# Altium schematic sheet OK1050-C_V1.2_Lcd.SchDoc
size A3; Revision: 1.2; SheetNumber: 3; SheetTotal: 7
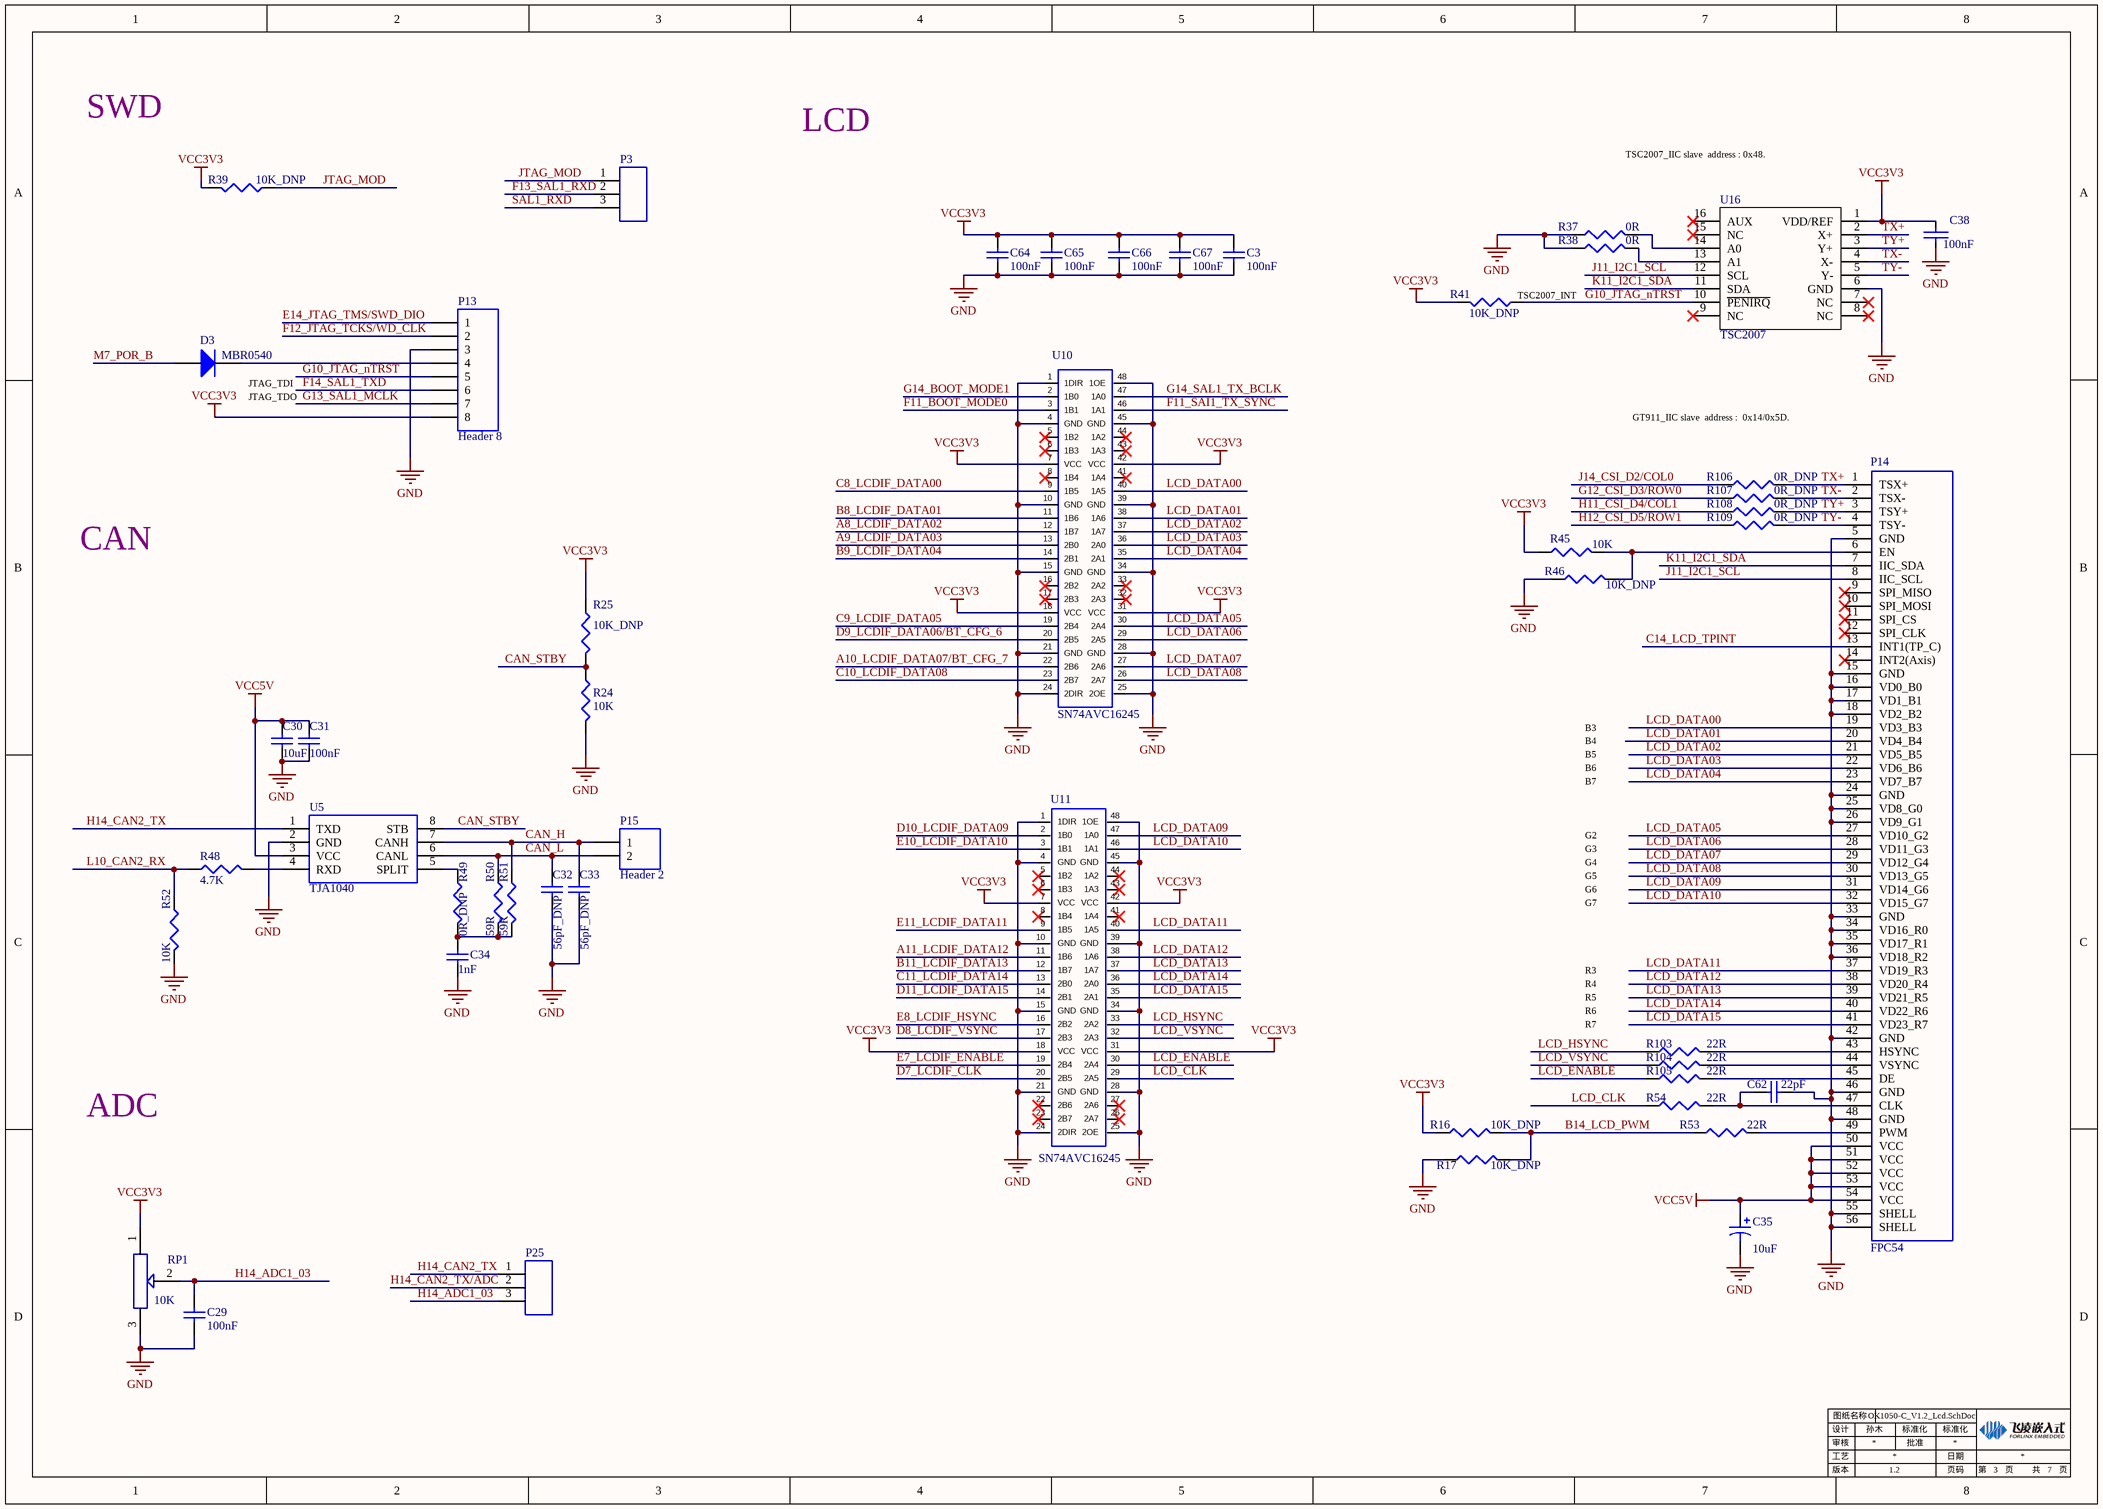
[diagram p0: OK1050-C_V1.2_Lcd.SchDoc]

## Parts
C3  100nF  [0603C+]
C29  100nF  [0603C+]
C30  10uF  [0603C+]
C31  100nF  [0603C+]
C32  56pF_DNP  [0603C+]
C33  56pF_DNP  [0603C+]
C34  1nF  [0603C+]
C35  10uF  [TC3216A]
C38  100nF  [0603C+]
C62  22pF  [0603C+]
C64  100nF  [0603C+]
C65  100nF  [0603C+]
C66  100nF  [0603C+]
C67  100nF  [0603C+]
D3  MBR0540  [Diode1.6*2.6]
P3  P25  [HDR1X3]  (value not drawn)
P13  Header 8  [HDR1X8]
P14  FPC54  [FPC54]
P15  Header 2  [DG128-2P]
P25  P25  [HDR1X3]  (value not drawn)
R16  10K_DNP  [0603R+]
R17  10K_DNP  [0603R+]
R24  10K  [0603R+]
R25  10K_DNP  [0603R+]
R37  0R  [0603R+]
R38  0R  [0603R+]
R39  10K_DNP  [0603R+]
R41  10K_DNP  [0603R+]
R45  10K  [0603R+]
R46  10K_DNP  [0603R+]
R48  4.7K  [0603R+]
R49  0R_DNP  [0603R+]
R50  59R  [0603R+]
R51  59R  [0603R+]
R52  10K  [0603R+]
R53  22R  [0603R+]
R54  22R  [0603R+]
R103  22R  [0603R+]
R104  22R  [0603R+]
R105  22R  [0603R+]
R106  0R_DNP  [0603R+]
R107  0R_DNP  [0603R+]
R108  0R_DNP  [0603R+]
R109  0R_DNP  [0603R+]
RP1  value 10K  [3296W]  (hidden comment: VR-3296W)
U5  TJA1040  [SOP127P600X175-8N]
U10  SN74AVC16245  [SN74VC16245]
U11  SN74AVC16245  [SN74VC16245]
U16  TSC2007  [TSC2007]

## Nets
GND: C3.1 C29.1 C30.2 C31.2 C32.2 C33.2 C34.2 C35.2 C38.2 C62.2 C64.1 C65.1 C66.1 C67.1 P13.3 P14.5(GND) P14.15(GND) P14.16(VD0_B0) P14.17(VD1_B1) P14.18(VD2_B2) P14.24(GND) P14.25(VD8_G0) P14.26(VD9_G1) P14.33(GND) P14.34(VD16_R0) P14.35(VD17_R1) P14.36(VD18_R2) P14.42(GND) P14.46(GND) P14.48(GND) P14.55(SHELL) P14.56(SHELL) R17.1 R24.2 R37.1 R38.1 R46.1 R52.2 RP1.3(VCC) U5.2(GND) U10.1(1DIR) U10.4(GND) U10.10(GND) U10.15(GND) U10.21(GND) U10.24(2DIR) U10.25(2OE) U10.28(GND) U10.34(GND) U10.39(GND) U10.45(GND) U10.48(1OE) U11.1(1DIR) U11.4(GND) U11.10(GND) U11.15(GND) U11.21(GND) U11.24(2DIR) U11.25(2OE) U11.28(GND) U11.34(GND) U11.39(GND) U11.45(GND) U11.48(1OE) U16.6(GND)
VCC3V3: C3.2 C38.1 C64.2 C65.2 C66.2 C67.2 P13.8 R16.1 R25.1 R39.2 R41.2 R45.1 RP1.1(VCC) U10.7(VCC) U10.18(VCC) U10.31(VCC) U10.42(VCC) U11.7(VCC) U11.18(VCC) U11.31(VCC) U11.42(VCC) U16.1(VDD/REF)
VCC5V: C30.1 C31.1 C35.1 P14.50(VCC) P14.51(VCC) P14.52(VCC) P14.53(VCC) P14.54(VCC) U5.3(VCC)
A8_LCDIF_DATA02: U10.12(1B7)
A9_LCDIF_DATA03: U10.13(2B0)
A10_LCDIF_DATA07/BT_CFG_7: U10.22(2B6)
A11_LCDIF_DATA12: U11.11(1B6)
B8_LCDIF_DATA01: U10.11(1B6)
B9_LCDIF_DATA04: U10.14(2B1)
B11_LCDIF_DATA13: U11.12(1B7)
B14_LCD_PWM: R16.2 R17.2 R53.1
C8_LCDIF_DATA00: U10.9(1B5)
C9_LCDIF_DATA05: U10.19(2B4)
C10_LCDIF_DATA08: U10.23(2B7)
C11_LCDIF_DATA14: U11.13(2B0)
C14_LCD_TPINT: P14.13(INT1(TP_C))
CAN_H: C33.1 P15.1 R51.1 U5.7(CANH)
CAN_L: C32.1 P15.2 R50.1 U5.6(CANL)
CAN_STBY: R24.1 R25.2 U5.8(STB)
D7_LCDIF_CLK: U11.20(2B5)
D8_LCDIF_VSYNC: U11.17(2B3)
D9_LCDIF_DATA06/BT_CFG_6: U10.20(2B5)
D10_LCDIF_DATA09: U11.2(1B0)
D11_LCDIF_DATA15: U11.14(2B1)
E7_LCDIF_ENABLE: U11.19(2B4)
E8_LCDIF_HSYNC: U11.16(2B2)
E10_LCDIF_DATA10: U11.3(1B1)
E11_LCDIF_DATA11: U11.9(1B5)
E14_JTAG_TMS/SWD_DIO: P13.1
F11_BOOT_MODE0: U10.3(1B1)
F11_SAI1_TX_SYNC: U10.46(1A1)
F12_JTAG_TCKS/WD_CLK: P13.2
F13_SAL1_RXD: P3.2(DQ17)
F14_SAL1_TXD: P13.6
G10_JTAG_nTRST: P13.5 R41.1 U16.10(~{PENIRQ})
G12_CSI_D3/ROW0: R107.1
G13_SAL1_MCLK: P13.7
G14_BOOT_MODE1: U10.2(1B0)
G14_SAL1_TX_BCLK: U10.47(1A0)
H11_CSI_D4/COL1: R108.1
H12_CSI_D5/ROW1: R109.1
H14_ADC1_03: C29.2 P25.3(DQ18) RP1.2(VCC)
H14_CAN2_TX: P25.1(DQ16) U5.1(TXD)
H14_CAN2_TX/ADC: P25.2(DQ17)
J11_I2C1_SCL: P14.8(IIC_SCL) U16.12(SCL)
J14_CSI_D2/COL0: R106.1
JTAG_MOD: P3.1(DQ16) R39.1
K11_I2C1_SDA: P14.7(IIC_SDA) U16.11(SDA)
L10_CAN2_RX: R48.1 R52.1
LCD_CLK: R54.1 U11.29(2A5)
LCD_DATA00: P14.19(VD3_B3) U10.40(1A5)
LCD_DATA01: P14.20(VD4_B4) U10.38(1A6)
LCD_DATA02: P14.21(VD5_B5) U10.37(1A7)
LCD_DATA03: P14.22(VD6_B6) U10.36(2A0)
LCD_DATA04: P14.23(VD7_B7) U10.35(2A1)
LCD_DATA05: P14.27(VD10_G2) U10.30(2A4)
LCD_DATA06: P14.28(VD11_G3) U10.29(2A5)
LCD_DATA07: P14.29(VD12_G4) U10.27(2A6)
LCD_DATA08: P14.30(VD13_G5) U10.26(2A7)
LCD_DATA09: P14.31(VD14_G6) U11.47(1A0)
LCD_DATA10: P14.32(VD15_G7) U11.46(1A1)
LCD_DATA11: P14.37(VD19_R3) U11.40(1A5)
LCD_DATA12: P14.38(VD20_R4) U11.38(1A6)
LCD_DATA13: P14.39(VD21_R5) U11.37(1A7)
LCD_DATA14: P14.40(VD22_R6) U11.36(2A0)
LCD_DATA15: P14.41(VD23_R7) U11.35(2A1)
LCD_ENABLE: R105.1 U11.30(2A4)
LCD_HSYNC: R103.1 U11.33(2A2)
LCD_VSYNC: R104.1 U11.32(2A3)
M7_POR_B: D3.1(A)
SAL1_RXD: P3.3(DQ18)
TX+: P14.1(TSX+) R106.2 U16.2(X+)
TX-: P14.2(TSX-) R107.2 U16.4(X-)
TY+: P14.3(TSY+) R108.2 U16.3(Y+)
TY-: P14.4(TSY-) R109.2 U16.5(Y-)
NetC34_1: C34.1 R49.2 R50.2 R51.2
NetC62_1: C62.1 P14.47(CLK) R54.2
NetD3_2: D3.2(K) P13.4
NetP14_6: P14.6(EN) R45.2 R46.2
NetP14_43: P14.43(HSYNC) R103.2
NetP14_44: P14.44(VSYNC) R104.2
NetP14_45: P14.45(DE) R105.2
NetP14_49: P14.49(PWM) R53.2
NetR37_2: R37.2 U16.14(A0)
NetR38_2: R38.2 U16.13(A1)
NetR48_2: R48.2 U5.4(RXD)
NetR49_1: R49.1 U5.5(SPLIT)

Not connected (* = marked no-connect by the designer): P14 9(SPI_MISO)* 10(SPI_MOSI)* 11(SPI_CS)* 12(SPI_CLK)* 14(INT2(Axis))*; U10 5(1B2)* 6(1B3)* 8(1B4)* 16(2B2)* 17(2B3)* 32(2A3)* 33(2A2)* 41(1A4)* 43(1A3)* 44(1A2)*; U11 5(1B2)* 6(1B3)* 8(1B4)* 22(2B6)* 23(2B7)* 26(2A7)* 27(2A6)* 41(1A4)* 43(1A3)* 44(1A2)*; U16 7(NC)* 8(NC)* 9(NC)* 15(NC)* 16(AUX)*

## Notes on the sheet
- SWD
- LCD
- TSC2007_IIC slave  address : 0x48.
- (near R41) TSC2007_INT
- (near D3) JTAG_TDI
- (near D3) JTAG_TDO
- GT911_IIC slave  address :  0x14/0x5D.
- CAN
- B3
- B4
- B5
- B7
- B6
- G2
- G3
- G4
- G5
- G7
- G6
- R3
- R4
- R5
- R7
- R6
- ADC
- 设计
- 审核
- 工艺
- 图纸名称
- 孙木
- 批准
- 标准化
- 日期
- 版本
- 页码
- 第
- 页
- 共

## Library data of the parts
C3 C29-C34 C62 C64-C67 = Cap: Capacitor; Published: 8-Jun-2000; LatestRevisionDate: 17-Jul-2002; LatestRevisionNote: Re-released for DXP Platform.; PackageReference: RAD-0.3; Publisher: Altium Limited; PackageDescription: Radial Cap, Thru-Hole; 2 Leads; 0.3 in Pin Spacing
  C3 C29 C31 C64-C67: Value: 100nF
  C30: Value: 10uF
  C32 C33: Value: 56pF_DNP
  C34: Value: 1nF
  C62: Value: 22pF
C35 = Cap Pol1: Polarized Capacitor (Radial); Published: 8-Jun-2000; LatestRevisionDate: 17-Jul-2002; LatestRevisionNote: Re-released for DXP Platform.; PackageReference: RB7.6-15; Publisher: Altium Limited; PackageDescription: Polarized Capacitor (Radial); 2 Leads; Value: 10uF
C38 = CAP_1: value: 100nF
D3 = Diode: Default Diode; Published: 8-Jun-2000; LatestRevisionDate: 17-Jul-2002; LatestRevisionNote: Re-released for DXP Platform.; PackageVersion: Sep-1996; PackageReference: SMC; Publisher: Altium Limited; PackageDescription: DO-214-AB/SMC; 2 C-Bend Leads; Body 7.9 x 5.9 mm, inc. leads (LxW); Code_JEDEC: DO-214-AB
P3 P25 = CON3
P13 = Header 8: Header, 8-Pin; LatestRevisionDate: 17-Jul-2002; LatestRevisionNote: Re-released for DXP Platform.; Publisher: Altium Limited
R16 R17 R24 R25 R37-R39 R41 R45 R46 R48-R54 R103-R109 = Res3: Resistor; Published: 8-Jun-2000; LatestRevisionDate: 29-May-2009; LatestRevisionNote: IPC-7351 Footprint Added.; PackageReference: J1-0603; Publisher: Altium Limited; PackageDescription: Chip Resistor
  R16 R17 R25 R39 R41 R46: Value: 10K_DNP
  R24 R45 R52: Value: 10K
  R37 R38: Value: 0R
  R48: Value: 4.7K
  R49 R106-R109: Value: 0R_DNP
  R50 R51: Value: 59R
  R53 R54 R103-R105: Value: 22R
RP1 = VR